# Altium schematic sheet Hall_Input.SchDoc
size A4
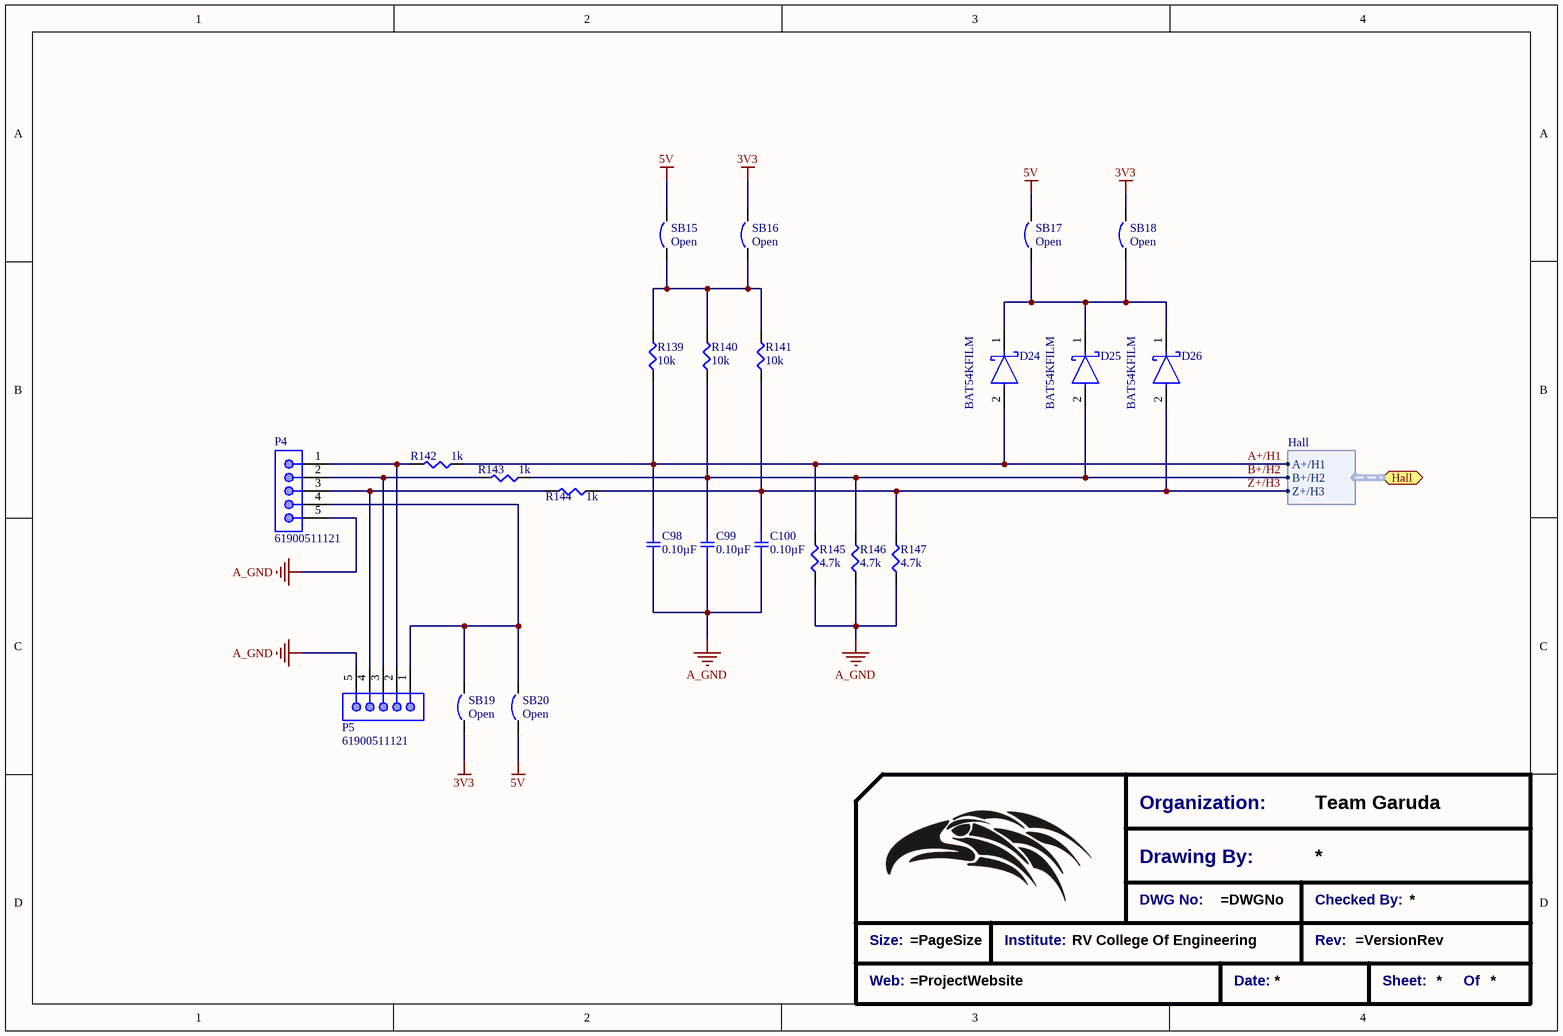
[diagram p0: Hall_Input.SchDoc]

## Parts
*?  Title_Block  (value not drawn)  (graphical)
C98  0.10µF  [SMD-0805C]
C99  0.10µF  [SMD-0805C]
C100  0.10µF  [SMD-0805C]
D24  BAT54KFILM  [FP-SOD-523-MFG]
D25  BAT54KFILM  [FP-SOD-523-MFG]
D26  BAT54KFILM  [FP-SOD-523-MFG]
P4  61900511121  [61900511121]
P5  61900511121  [61900511121]
R139  10k  [SMD-0603-RES]
R140  10k  [SMD-0603-RES]
R141  10k  [SMD-0603-RES]
R142  1k  [SMD-0603-RES]
R143  1k  [SMD-0603-RES]
R144  1k  [SMD-0603-RES]
R145  4.7k  [SMD-0603-RES]
R146  4.7k  [SMD-0603-RES]
R147  4.7k  [SMD-0603-RES]
SB15  Open  [Solder Bridge - HP - SQ]  (no BOM)
SB16  Open  [Solder Bridge - HP - SQ]  (no BOM)
SB17  Open  [Solder Bridge - HP - SQ]  (no BOM)
SB18  Open  [Solder Bridge - HP - SQ]  (no BOM)
SB19  Open  [Solder Bridge - HP - SQ]  (no BOM)
SB20  Open  [Solder Bridge - HP - SQ]  (no BOM)

## Ports
Hall (bidir, harness Hall)

## Harnesses
Hall: A+/H1, B+/H2, Z+/H3

## Nets
3V3: SB16.2 SB18.2 SB19.1
5V: SB15.2 SB17.2 SB20.1
A_GND: C98.1 C99.1 C100.1 P4.5 P5.5 R145.1 R146.1 R147.1
A+/H1: C98.2 D24.2(A) R139.1 R142.1 R145.2 ; port Hall.A+/H1
B+/H2: C99.2 D25.2(A) R140.1 R143.1 R146.2 ; port Hall.B+/H2
Z+/H3: C100.2 D26.2(A) R141.1 R144.1 R147.2 ; port Hall.Z+/H3
NetD24_1: D24.1(C) D25.1(C) D26.1(C) SB17.1 SB18.1
NetP4_1: P4.1 P5.2 R142.2
NetP4_2: P4.2 P5.3 R143.2
NetP4_3: P4.3 P5.4 R144.2
NetP4_4: P4.4 P5.1 SB19.2 SB20.2
NetR139_2: R139.2 R140.2 R141.2 SB15.1 SB16.1

## Notes on the sheet
- (in symbol Title_Block) Organization:; Team Garuda; Drawing By:; DWG No:; Checked By:; Size:; Institute:; RV College Of Engineering; Rev:; Web:; Date:; Sheet:; Of

## Library data of the parts
*? = Title_Block: Standard Title Block
C98-C100 = GCD21BR71H104KA01L: CAP CER 0.1UF 50V X7R 0805; Manufacturer: Murata Electronics North America; Factory Stock: 0; Unit Price (USD): 0.24; Minimum Quantity: 1; Tolerance: ±10%; Datasheets: http://www.murata.com/~/media/webrenewal/support/library/catalog/products/capacitor/mlcc/c03e.ashx; Image: //media.digikey.com/Renders/Murata%20Renders/0805%28GxM6%29.jpg; Digi-Key Part Number: 490-11955-1-ND; Part Number: GCD21BR71H104KA01L; Quantity Available: 157; @ qty: 0; Packaging: Cut Tape (CT); Series: GCD; Part Status: Active; Value: 0.10µF; Voltage: 50V; Temperature Coefficient: X7R; Operating Temperature: -55°C ~ 125°C; Features: -; Ratings: AEC-Q200; Applications: Automotive; Mounting Type: Surface Mount, MLCC; Package / Case: 0805 (2012 Metric); Size / Dimension: 0.079" L x 0.049" W (2.00mm x 1.25mm); Height - Seated (Max): -; Thickness (Max): 0.049" (1.25mm); Lead Spacing: -; Lead Style: -
D24-D26 = CMP-12187-000026-1: DIODE SCHOTTKY 40V 300MA SOD523; Manufacturer: STMicroelectronics; Capacitance: 7pF; Value: 7pF; Max Surge Forward Current: 1.25A; Peak Reverse Current: 1uA; Max Junction Temp: +150°C; Device Class L2: Diodes; Temperature Range Low: -40°C; Category: Diode; Manufacturer Part Number: BAT54KFILM; Digikey Description: DIODE SCHOTTKY 40V 300MA SOD523; Device Class L3: Schottky Diodes; Automotive: No; Height: 0.7mm; Octopart: https://octopart.com/bat54kfilm-stmicroelectronics-39618022; ComponentLink2Description: Datasheet; Temperature Range High: +150°C; Device Class L1: Discrete Semiconductors; Max Repetitive Reverse Voltage: 40V; RoHS: TRUE; Temperature: -40°C to +150°C; ComponentLink2URL: https://www.st.com/content/ccc/resource/technical/document/datasheet/07/50/54/f2/0d/ba/4a/79/CD00001322.pdf/files/CD00001322.pdf/jcr:content/translations/en.CD00001322.pdf; Lead Free: Yes; Forward Current: 300mA; Package: SOD-523; Mouser Description: Schottky Diodes & Rectifiers schottky diode
P4 P5 = 61900511121: WR-WTB THT Male Vertical Locking Header, pitch 2.54mm, 5p; Pin Number: 5; Contact Resistance: 20mOhm; Rated Current: 3A; Withstanding Voltage: 1000VAC; Working Voltage: 250VAC; ComponentLink1Description: Manufacturer; ComponentLink1URL: http://www.we-online.de; ComponentLink2Description: Datasheet; ComponentLink2URL: https://www.we-online.com/catalog/datasheet/61900511121.pdf; Pitch: 2.54mm; Published Date: January 2020; Publisher: Wurth Elektronik; Mounting Technology: THT; Packaging: Bag; Operating Temperature: -40 to +105degC; Part Number: 61900511121; Gender: Male; Type: Vertical
R139-R141 = ERJ-3EKF1002V: RES SMD 10K OHM 1% 1/10W 0603; Manufacturer: Panasonic Electronic Components; Factory Stock: 0; Unit Price (USD): 0.00379; @ qty: 1500; Minimum Quantity: 1; Power (Watts): 0.1W, 1/10W; Temperature Coefficient: ±100ppm/°C; Part Number: ERJ-3EKF1002V; Datasheets: http://industrial.panasonic.com/www-cgi/jvcr13pz.cgi?E+PZ+3+AOA0002+ERJ3EKF1002V+7+WW; Image: //media.digikey.com/Photos/Panasonic%20Photos/MFG_ERJ-P6W%20Series.jpg; Digi-Key Part Number: P10.0KHCT-ND; Quantity Available: 6703141; Packaging: Cut Tape (CT); Series: ERJ; Part Status: Active; Value: 10k; Tolerance: ±1%; Composition: Thick Film; Features: Automotive AEC-Q200; Operating Temperature: -55°C ~ 155°C; Package / Case: 0603 (1608 Metric); Supplier Device Package: 0603; Size / Dimension: 0.063" L x 0.031" W (1.60mm x 0.80mm); Height - Seated (Max): 0.022" (0.55mm); Number of Terminations: 2; Failure Rate: -
R142-R144 = ERJ-3EKF1001V: RES SMD 1K OHM 1% 1/10W 0603; Manufacturer: Panasonic Electronic Components; Factory Stock: 0; Unit Price (USD): 0.00379; @ qty: 1500; Minimum Quantity: 1; Power (Watts): 0.1W, 1/10W; Temperature Coefficient: ±100ppm/°C; Part Number: ERJ-3EKF1001V; Datasheets: http://industrial.panasonic.com/www-cgi/jvcr13pz.cgi?E+PZ+3+AOA0002+ERJ3EKF1001V+7+WW; Image: //media.digikey.com/Photos/Panasonic%20Photos/MFG_ERJ-P6W%20Series.jpg; Digi-Key Part Number: P1.00KHCT-ND; Quantity Available: 5218845; Packaging: Cut Tape (CT); Series: ERJ; Part Status: Active; Value: 1k; Tolerance: ±1%; Composition: Thick Film; Features: Automotive AEC-Q200; Operating Temperature: -55°C ~ 155°C; Package / Case: 0603 (1608 Metric); Supplier Device Package: 0603; Size / Dimension: 0.063" L x 0.031" W (1.60mm x 0.80mm); Height - Seated (Max): 0.022" (0.55mm); Number of Terminations: 2; Failure Rate: -
R145-R147 = ERJ-3GEYJ472V: RES SMD 4.7K OHM 5% 1/10W 0603; Manufacturer: Panasonic Electronic Components; Factory Stock: 0; Unit Price (USD): 0.00321; @ qty: 1500; Minimum Quantity: 1; Power (Watts): 0.1W, 1/10W; Temperature Coefficient: ±200ppm/°C; Part Number: ERJ-3GEYJ472V; Datasheets: http://industrial.panasonic.com/www-cgi/jvcr13pz.cgi?E+PZ+3+AOA0001+ERJ3GEYJ472V+7+WW; Image: //media.digikey.com/Photos/Panasonic%20Photos/MFG_ERJ-P6W%20Series.jpg; Digi-Key Part Number: P4.7KGCT-ND; Quantity Available: 683531; Packaging: Cut Tape (CT); Series: ERJ; Part Status: Active; Value: 4.7k; Tolerance: ±5%; Composition: Thick Film; Features: Automotive AEC-Q200; Operating Temperature: -55°C ~ 155°C; Package / Case: 0603 (1608 Metric); Supplier Device Package: 0603; Size / Dimension: 0.063" L x 0.031" W (1.60mm x 0.80mm); Height - Seated (Max): 0.022" (0.55mm); Number of Terminations: 2; Failure Rate: -
SB15-SB20 = Solder Bridge: Circuit Breaker; Published: 24-Mar-1999; Revision: July-2002: Re-released for DXP Platform.; Publisher: Altium Limited